# Altium project RESTURANT ROBOT.PrjPcb
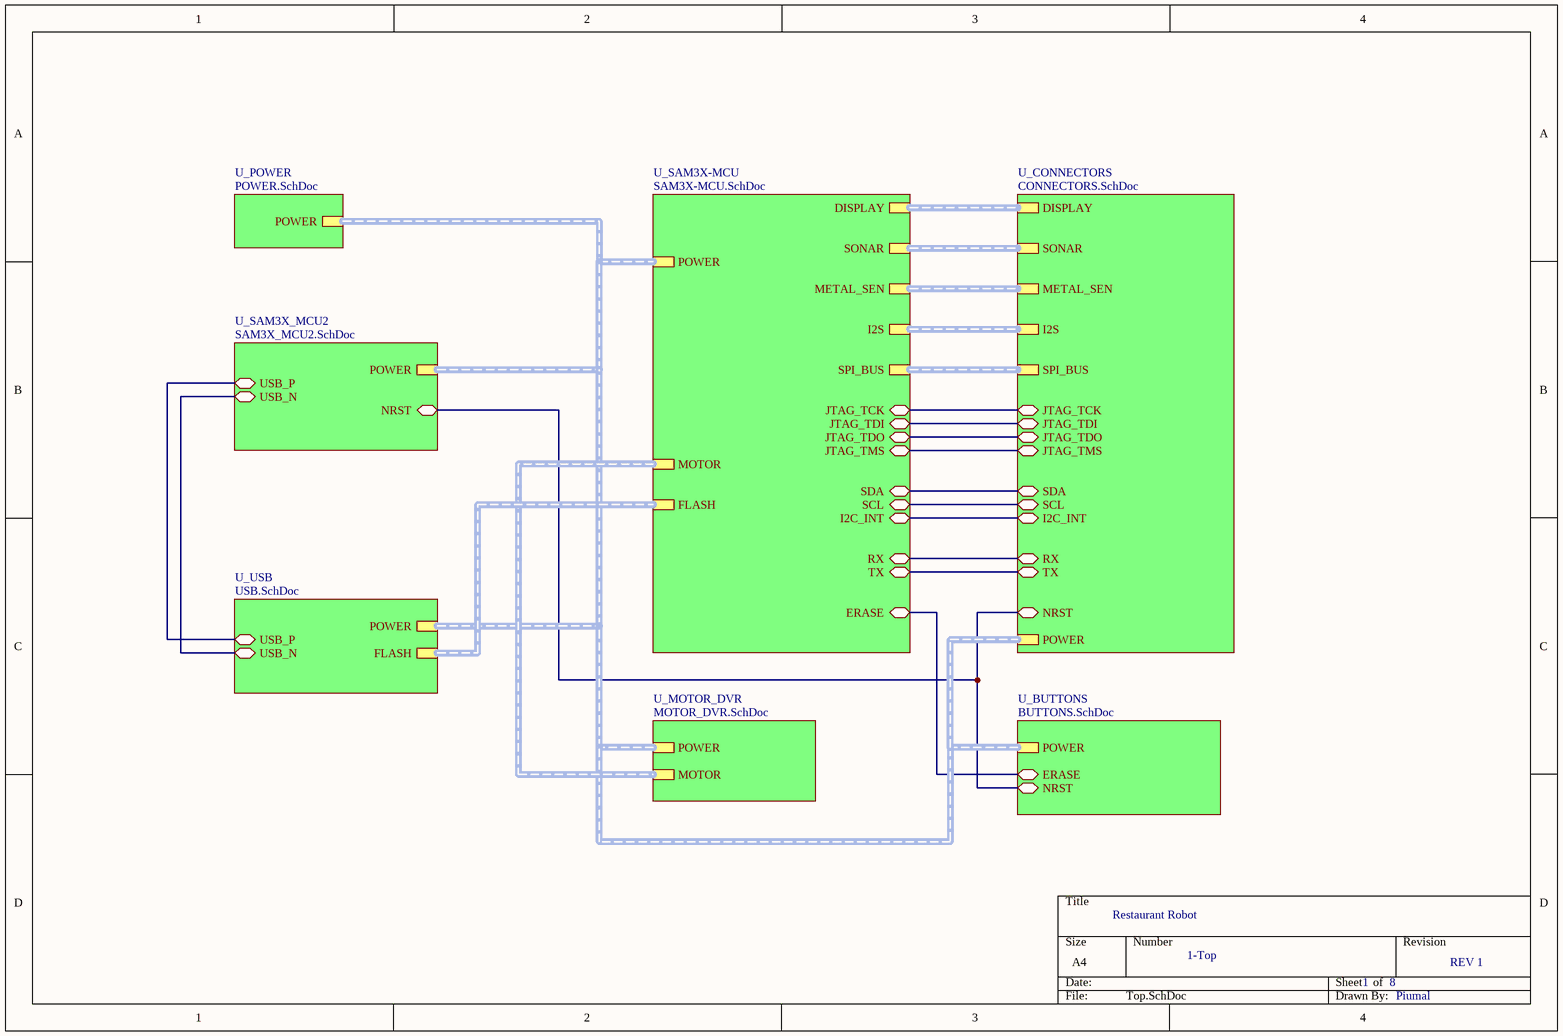
[diagram p0: Top.SchDoc]
4 sheets, 48 parts. Net scope: hierarchical (ports join the sheet entries above them; power ports are global).
Board file: PCB.PcbDoc
Sheets:
  Top.SchDoc
    U_SAM3X_MCU2 = SAM3X_MCU2.SchDoc
    U_BUTTONS = BUTTONS.SchDoc
    U_POWER = POWER.SchDoc

## Sheet Top.SchDoc
size A4; SheetNumber: 1; SheetTotal: 8

### Sub-sheets
U_BUTTONS = BUTTONS.SchDoc: ERASE (bidir), NRST (bidir), POWER (harness POWER)
U_CONNECTORS = CONNECTORS.SchDoc (file not in this document): DISPLAY (harness DISPLAY), SONAR (harness SONAR), METAL_SEN (harness METAL_SEN), I2S (harness I2S), JTAG_TCK (bidir), JTAG_TDI (bidir), JTAG_TDO (bidir), JTAG_TMS (bidir), RX (bidir), TX (bidir), SDA (bidir), SCL (bidir), I2C_INT (bidir), NRST (bidir), SPI_BUS (harness SPI_BUS), POWER (harness POWER)
U_MOTOR_DVR = MOTOR_DVR.SchDoc (file not in this document): MOTOR (harness MOTOR), POWER (harness POWER)
U_POWER = POWER.SchDoc: POWER (harness POWER)
U_SAM3X-MCU = SAM3X-MCU.SchDoc (file not in this document): MOTOR (harness MOTOR), FLASH (harness FLASH), SONAR (harness SONAR), I2S (harness I2S), METAL_SEN (harness METAL_SEN), DISPLAY (harness DISPLAY), JTAG_TCK (bidir), JTAG_TDI (bidir), JTAG_TDO (bidir), JTAG_TMS (bidir), RX (bidir), TX (bidir), ERASE (bidir), SDA (bidir), SCL (bidir), I2C_INT (bidir), SPI_BUS (harness SPI_BUS), POWER (harness POWER)
U_SAM3X_MCU2 = SAM3X_MCU2.SchDoc: USB_P (bidir), USB_N (bidir), NRST (bidir), POWER (harness POWER)
U_USB = USB.SchDoc (file not in this document): USB_P (bidir), USB_N (bidir), FLASH (harness FLASH), POWER (harness POWER)

### Nets
ERASE: sheet U_SAM3X-MCU/ERASE, sheet U_BUTTONS/ERASE
NRST: sheet U_SAM3X_MCU2/NRST, sheet U_BUTTONS/NRST, sheet U_CONNECTORS/NRST
USB_N: sheet U_SAM3X_MCU2/USB_N, sheet U_USB/USB_N
USB_P: sheet U_SAM3X_MCU2/USB_P, sheet U_USB/USB_P
(unnamed): sheet U_SAM3X-MCU/JTAG_TCK, sheet U_CONNECTORS/JTAG_TCK
(unnamed): sheet U_SAM3X-MCU/JTAG_TDI, sheet U_CONNECTORS/JTAG_TDI
(unnamed): sheet U_SAM3X-MCU/JTAG_TDO, sheet U_CONNECTORS/JTAG_TDO
(unnamed): sheet U_SAM3X-MCU/JTAG_TMS, sheet U_CONNECTORS/JTAG_TMS
(unnamed): sheet U_SAM3X-MCU/RX, sheet U_CONNECTORS/RX
(unnamed): sheet U_SAM3X-MCU/TX, sheet U_CONNECTORS/TX
(unnamed): sheet U_SAM3X-MCU/SDA, sheet U_CONNECTORS/SDA
(unnamed): sheet U_SAM3X-MCU/SCL, sheet U_CONNECTORS/SCL
(unnamed): sheet U_SAM3X-MCU/I2C_INT, sheet U_CONNECTORS/I2C_INT

### Buses and harness runs
harness sheet U_BUTTONS/POWER = sheet U_CONNECTORS/POWER = sheet U_MOTOR_DVR/POWER = sheet U_POWER/POWER = sheet U_SAM3X-MCU/POWER = sheet U_SAM3X_MCU2/POWER = sheet U_USB/POWER
harness sheet U_CONNECTORS/DISPLAY = sheet U_SAM3X-MCU/DISPLAY
harness sheet U_CONNECTORS/I2S = sheet U_SAM3X-MCU/I2S
harness sheet U_CONNECTORS/METAL_SEN = sheet U_SAM3X-MCU/METAL_SEN
harness sheet U_CONNECTORS/SONAR = sheet U_SAM3X-MCU/SONAR
harness sheet U_CONNECTORS/SPI_BUS = sheet U_SAM3X-MCU/SPI_BUS
harness sheet U_MOTOR_DVR/MOTOR = sheet U_SAM3X-MCU/MOTOR
harness sheet U_SAM3X-MCU/FLASH = sheet U_USB/FLASH

### Notes on the sheet
- Restaurant Robot
- 1-Top
- 1
- 8
- REV 1
- Piumal

## Sheet SAM3X_MCU2.SchDoc
size A3; SheetNumber: 3; SheetTotal: 8
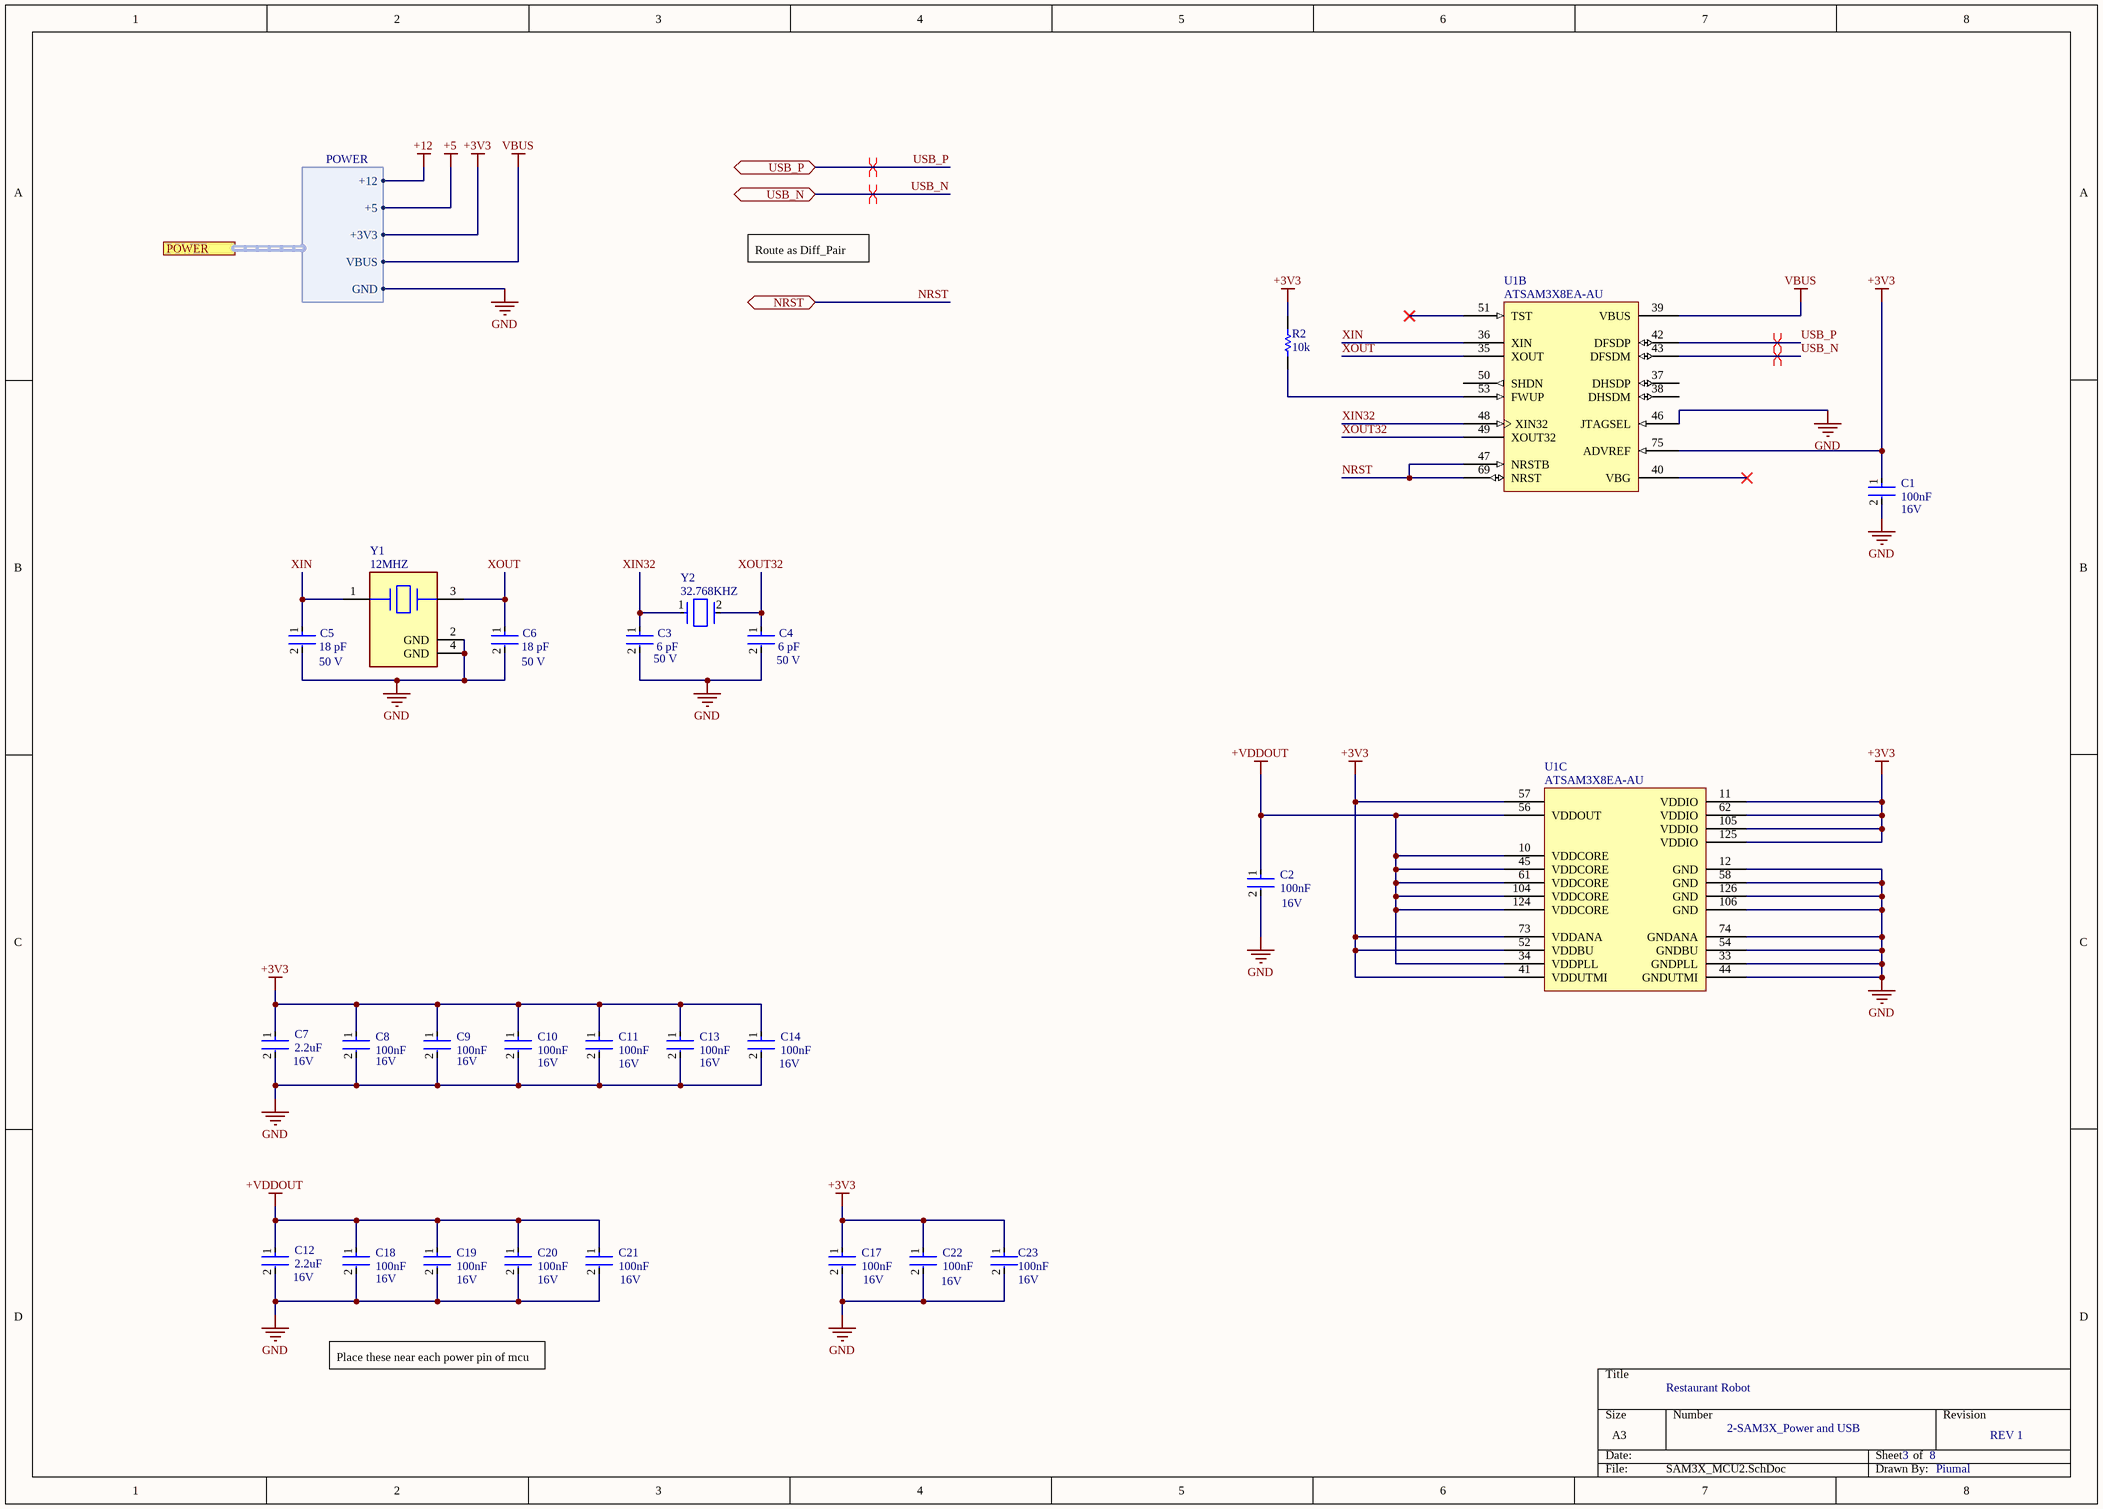
[diagram p1: SAM3X_MCU2.SchDoc]

### Parts
C1  Voltage Rating (DC): 16V  Capacitance: 100nF  [FP-CL21-IPC_A]  (hidden comment: CL21B104KOANNNC)
C2  Voltage Rating (DC): 16V  Capacitance: 100nF  [FP-CL21-IPC_A]  (hidden comment: CL21B104KOANNNC)
C3  Capacitance: 6 pF  Voltage Rating: 50 V  [FP-C0805C-DN-MFG]  (hidden comment: C0805C120J5GACTU)
C4  Capacitance: 6 pF  Voltage Rating: 50 V  [FP-C0805C-DN-MFG]  (hidden comment: C0805C120J5GACTU)
C5  Capacitance: 18 pF  Voltage Rating: 50 V  [FP-C0805C-DN-MFG]  (hidden comment: C0805C120J5GACTU)
C6  Capacitance: 18 pF  Voltage Rating: 50 V  [FP-C0805C-DN-MFG]  (hidden comment: C0805C120J5GACTU)
C7  Voltage Rating: 16V  Capacitance: 2.2uF  [FP-CL21-IPC_A]  (hidden comment: CL21A225KOFNNNG)
C8  Voltage Rating (DC): 16V  Capacitance: 100nF  [FP-CL21-IPC_A]  (hidden comment: CL21B104KOANNNC)
C9  Voltage Rating (DC): 16V  Capacitance: 100nF  [FP-CL21-IPC_A]  (hidden comment: CL21B104KOANNNC)
C10  Voltage Rating (DC): 16V  Capacitance: 100nF  [FP-CL21-IPC_A]  (hidden comment: CL21B104KOANNNC)
C11  Voltage Rating (DC): 16V  Capacitance: 100nF  [FP-CL21-IPC_A]  (hidden comment: CL21B104KOANNNC)
C12  Voltage Rating: 16V  Capacitance: 2.2uF  [FP-CL21-IPC_A]  (hidden comment: CL21A225KOFNNNG)
C13  Voltage Rating (DC): 16V  Capacitance: 100nF  [FP-CL21-IPC_A]  (hidden comment: CL21B104KOANNNC)
C14  Voltage Rating (DC): 16V  Capacitance: 100nF  [FP-CL21-IPC_A]  (hidden comment: CL21B104KOANNNC)
C17  Voltage Rating (DC): 16V  Capacitance: 100nF  [FP-CL21-IPC_A]  (hidden comment: CL21B104KOANNNC)
C18  Voltage Rating (DC): 16V  Capacitance: 100nF  [FP-CL21-IPC_A]  (hidden comment: CL21B104KOANNNC)
C19  Voltage Rating (DC): 16V  Capacitance: 100nF  [FP-CL21-IPC_A]  (hidden comment: CL21B104KOANNNC)
C20  Voltage Rating (DC): 16V  Capacitance: 100nF  [FP-CL21-IPC_A]  (hidden comment: CL21B104KOANNNC)
C21  Voltage Rating (DC): 16V  Capacitance: 100nF  [FP-CL21-IPC_A]  (hidden comment: CL21B104KOANNNC)
C22  Voltage Rating (DC): 16V  Capacitance: 100nF  [FP-CL21-IPC_A]  (hidden comment: CL21B104KOANNNC)
C23  value 100nF  Voltage Rating (DC): 16V  [FP-CL21-IPC_A]  (hidden comment: CL21B104KOANNNC)
R2  Resistance: 10k  [RESC2013X60X35ML10T20]  (hidden comment: RC0805JR-0710KL)
U1  ATSAM3X8EA-AU  [LQFP144_M]  (parts B,C of 3)
Y1  12MHZ  [FP-ABM8G-MFG]
Y2  32.768KHZ  [FP-NX3215SA-MFG]

### Ports
NRST (bidir), POWER (harness POWER), USB_N (bidir), USB_P (bidir)

### Harnesses
POWER: +3V3, GND, +5, VBUS, +12

### Nets
+3V3: C1.1 C7.1 C8.1 C9.1 C10.1 C11.1 C13.1 C14.1 C17.1 C22.1 C23.1 R2.2 U1.11(VDDIO) U1.41(VDDUTMI) U1.52(VDDBU) U1.57(VDDIN) U1.62(VDDIO) U1.73(VDDANA) U1.75(ADVREF) U1.105(VDDIO) U1.125(VDDIO) ; port POWER.+3V3
+VDDOUT: C2.1 C12.1 C18.1 C19.1 C20.1 C21.1 U1.10(VDDCORE) U1.34(VDDPLL) U1.45(VDDCORE) U1.56(VDDOUT) U1.61(VDDCORE) U1.104(VDDCORE) U1.124(VDDCORE)
GND: C1.2 C2.2 C3.2 C4.2 C5.2 C6.2 C7.2 C8.2 C9.2 C10.2 C11.2 C12.2 C13.2 C14.2 C17.2 C18.2 C19.2 C20.2 C21.2 C22.2 C23.2 U1.12(GND) U1.33(GNDPLL) U1.44(GNDUTMI) U1.46(JTAGSEL) U1.54(GNDBU) U1.58(GND) U1.74(GNDANA) U1.106(GND) U1.126(GND) Y1.2(GND) Y1.4(GND) ; port POWER.GND
VBUS: U1.39(VBUS) ; port POWER.VBUS
NRST: U1.47(NRSTB) U1.69(NRST) ; port NRST
USB_N: U1.43(DFSDM) ; port USB_N
USB_P: U1.42(DFSDP) ; port USB_P
XIN: C5.1 U1.36(XIN) Y1.1
XIN32: C3.1 U1.48(XIN32) Y2.1
XOUT: C6.1 U1.35(XOUT) Y1.3
XOUT32: C4.1 U1.49(XOUT32) Y2.2
NetR2_1: R2.1 U1.53(FWUP)

Not connected (* = marked no-connect by the designer): U1 37(DHSDP) 38(DHSDM) 40(VBG)* 50(SHDN) 51(TST)*

### Layout directives
differential pair; rule Signal Stimulus [Kind - Single Pulse    Level - High    Start Time = 0.000    Stop Time = 41.67    Period Time = 83.33]: USB_P
differential pair: USB_N, USB_P

### Notes on the sheet
- Route as Diff_Pair
- Place these near each power pin of mcu
- Restaurant Robot
- 2-SAM3X_Power and USB
- 3
- 8
- REV 1
- Piumal

### Library data of the parts
C1 C2 C8-C11 C13 C14 C17-C23 = CMP-13271-003679-1: CL21 Series 0805 100nF 16V ±10% Tolerance X7R Multilayer Ceramic Chip Capacitor; Lead Free: Lead Free; Width: 0.049inch; Tolerance: 10%; Min Operating Temperature: -55°C; Dielectric: X7R; Case Code (Metric): 2012; Packaging: Tape and Reel; Radiation Hardening: No; Length: 2mm; Height: 0.65mm; Voltage Rating: 16V; Mount: Surface Mount; Max Operating Temperature: 125°C; Depth: 1.25mm; Thickness: 0.03inch; Case Code (Imperial): 0805; Case/Package: 0805; Package Quantity: 1
C3-C6 = CMP-2007-00441-2: CAP CER 12PF 50V C0G/NP0 0805; Manufacturer: KEMET; Temperature Characteristic: C0G; Temperature Coefficient: 30ppm/°C; Material: Ceramic; Tolerance: 0.05; Height: 0.88mm; ComponentLink2URL: https://content.kemet.com/datasheets/KEM_C1003_C0G_SMD.pdf; Automotive: No; Device Class L2: Capacitors; Digikey Description: CAP CER 12PF 50V C0G/NP0 0805; Value: 12 pF; Device Class L3: Ceramic Capacitors; Mouser Description: Multilayer Ceramic Capacitors MLCC - SMD/SMT 50volts 12pF C0G 5%; Device Class L1: Passive Components; ComponentLink2Description: Datasheet; RoHS: TRUE; Temperature Range High: +125°C; Lead Free: Yes; Category: Cap; Ipc Land Pattern Name: CAPC200125X78; Package: C0805C-DN; Manufacturer Part Number: C0805C120J5GACTU; Octopart: https://octopart.com/c0805c120j5gactu-kemet-126518; Temperature Range Low: -55°C; Temperature: -55°C to +125°C
C7 C12 = CMP-13271-001347-1: CL21 Series 0805 2.2uF 16V ±10% Tolerance X5R Multilayer Ceramic Chip Capacitor; Width: 0.049inch; Min Operating Temperature: -55°C; Length: 0.079inch; Mount: Surface Mount; Tolerance: 10%; Package Quantity: 3000; Case Code (Imperial): 0805; Case Code (Metric): 2012; Thickness: 0.053inch; Packaging: Tape and Reel; Case/Package: 0805; Max Operating Temperature: 85°C
R2 = CMP-2000-05025-1: Chip Resistor, 10 KOhm, +/- 5%, 0.125 W, -55 to 155 degC, 0805 (2012 Metric), RoHS, Tape and Reel; Manufacturer: Yageo; Resistor Element Type: ThickFilm; Voltage Rating: 150V; Product Range: RCSeries; SVHC: ToBeAdvised; Resistor Case Style: 0805[2012Metric]; Temperature Coefficient: ±100ppm/degC; Power Rating: 250mW; Automotive Qualification Standard: -; Datasheet Version: REV. 2, 09/2004; Packaging: CutTape; Resistance Tolerance: ±5%; MSL: MSL1-Unlimited; Manufacturer URL: http://www.yageo.com/; Datasheet URL: http://www.yageo.ru/pdf/RC0805.pdf; Package Description: 2-Pin Surface Mounted Device, Body 2 x 1.25 mm; Package Reference: 805
U1 = CMP-0076-00188-1: SAM3X ARM Cortex-M3 Flash-based Microcontroller, 512 KB Flash, 96 KB SRAM, 103 User I/Os, 1.62 to 3.6 V, -40 to 85 degC, 144-Pin LQFP, RoHS; Manufacturer: Atmel; UART: 5; Max. Operating Freq.: 84 MHz; ADC Resolution: 12 bits; Flash: 512 Kbytes; ADC Channels: 16; SRAM: 96 Kbytes; Max I/O Pins: 103; DAC Channels: 2; SPI: 4; # of Touch Channels: 32; Mounting Technology: Surface Mount; Operating Voltage: 1.62 to 3.6 V; ComponentLink2URL: http://www.atmel.com/Images/doc11057.pdf; CAN: 2; ComponentLink1Description: Manufacturer URL; RoHS: TRUE; PartNumber: ATSAM3X8EA-AU; Temp. Range: -40 to 85 degC; PackageVersion: 11057B; PackageDescription: 100-Pin Quad Flat Package, Body 20 x 20 mm, Pitch 0.5 mm; ComponentLink2Description: Datasheet; DatasheetVersion: 11057B; ComponentLink1URL: http://www.atmel.com/; ComponentLink3Description: Package Specification; ComponentLink3URL: http://www.atmel.com/Images/doc11057.pdf; PackageReference: LQFP-144
Y1 = CMP-2000-05039-3: Crystal 12MHz ±20ppm (Tol) ±30ppm (Stability) 18pF FUND 120Ω 4-Pin SMD T/R; Series Resistance: 120R; Max Operating Temperature: 85°C; Mount: Surface Mount; Width: 2.5mm; Series: ABM8G; Termination: SMD/SMT; Frequency Tolerance: 20ppm; Tolerance: 20ppm; Min Operating Temperature: -40°C; Operating Frequency: 12 MHz; Depth: 2.5mm; Load Capacitance: 18pF; Number of Pins: 4; Length: 3.2mm; Radiation Hardening: No; Frequency Stability: 30ppm; Height: 1mm; Packaging: Tape and Reel; Package Quantity: 1000; ESR (Equivalent Series Resistance): 120R; Lead Free: Lead Free; Frequency: 12MHz; Case/Package: CSMD; Parameter 1: *
Y2 = CMP-00536-22488149-1: NX3215SA-32.768K-STD-MUA-14 Parallel - Fundamental Quartz Crystal, 0.032768MHz Nom; ESR (Equivalent Series Resistance): 70kΩ; Frequency Tolerance: 0.002%; Load Capacitance: 6pF; Width: 1.4986mm; Length: 3.2004mm; RoHS: Compliant; Case/Package: SMD/SMT; Mount: Surface Mount; Height: 889µm; Number of Pins: 2; Packaging: Tape & Reel (TR); Max Operating Temperature: 85°C; Frequency: 32.768kHz; NexarPartId: 22488149; Min Operating Temperature: -40°C

## Sheet BUTTONS.SchDoc
size A3; SheetNumber: 6; SheetTotal: 8
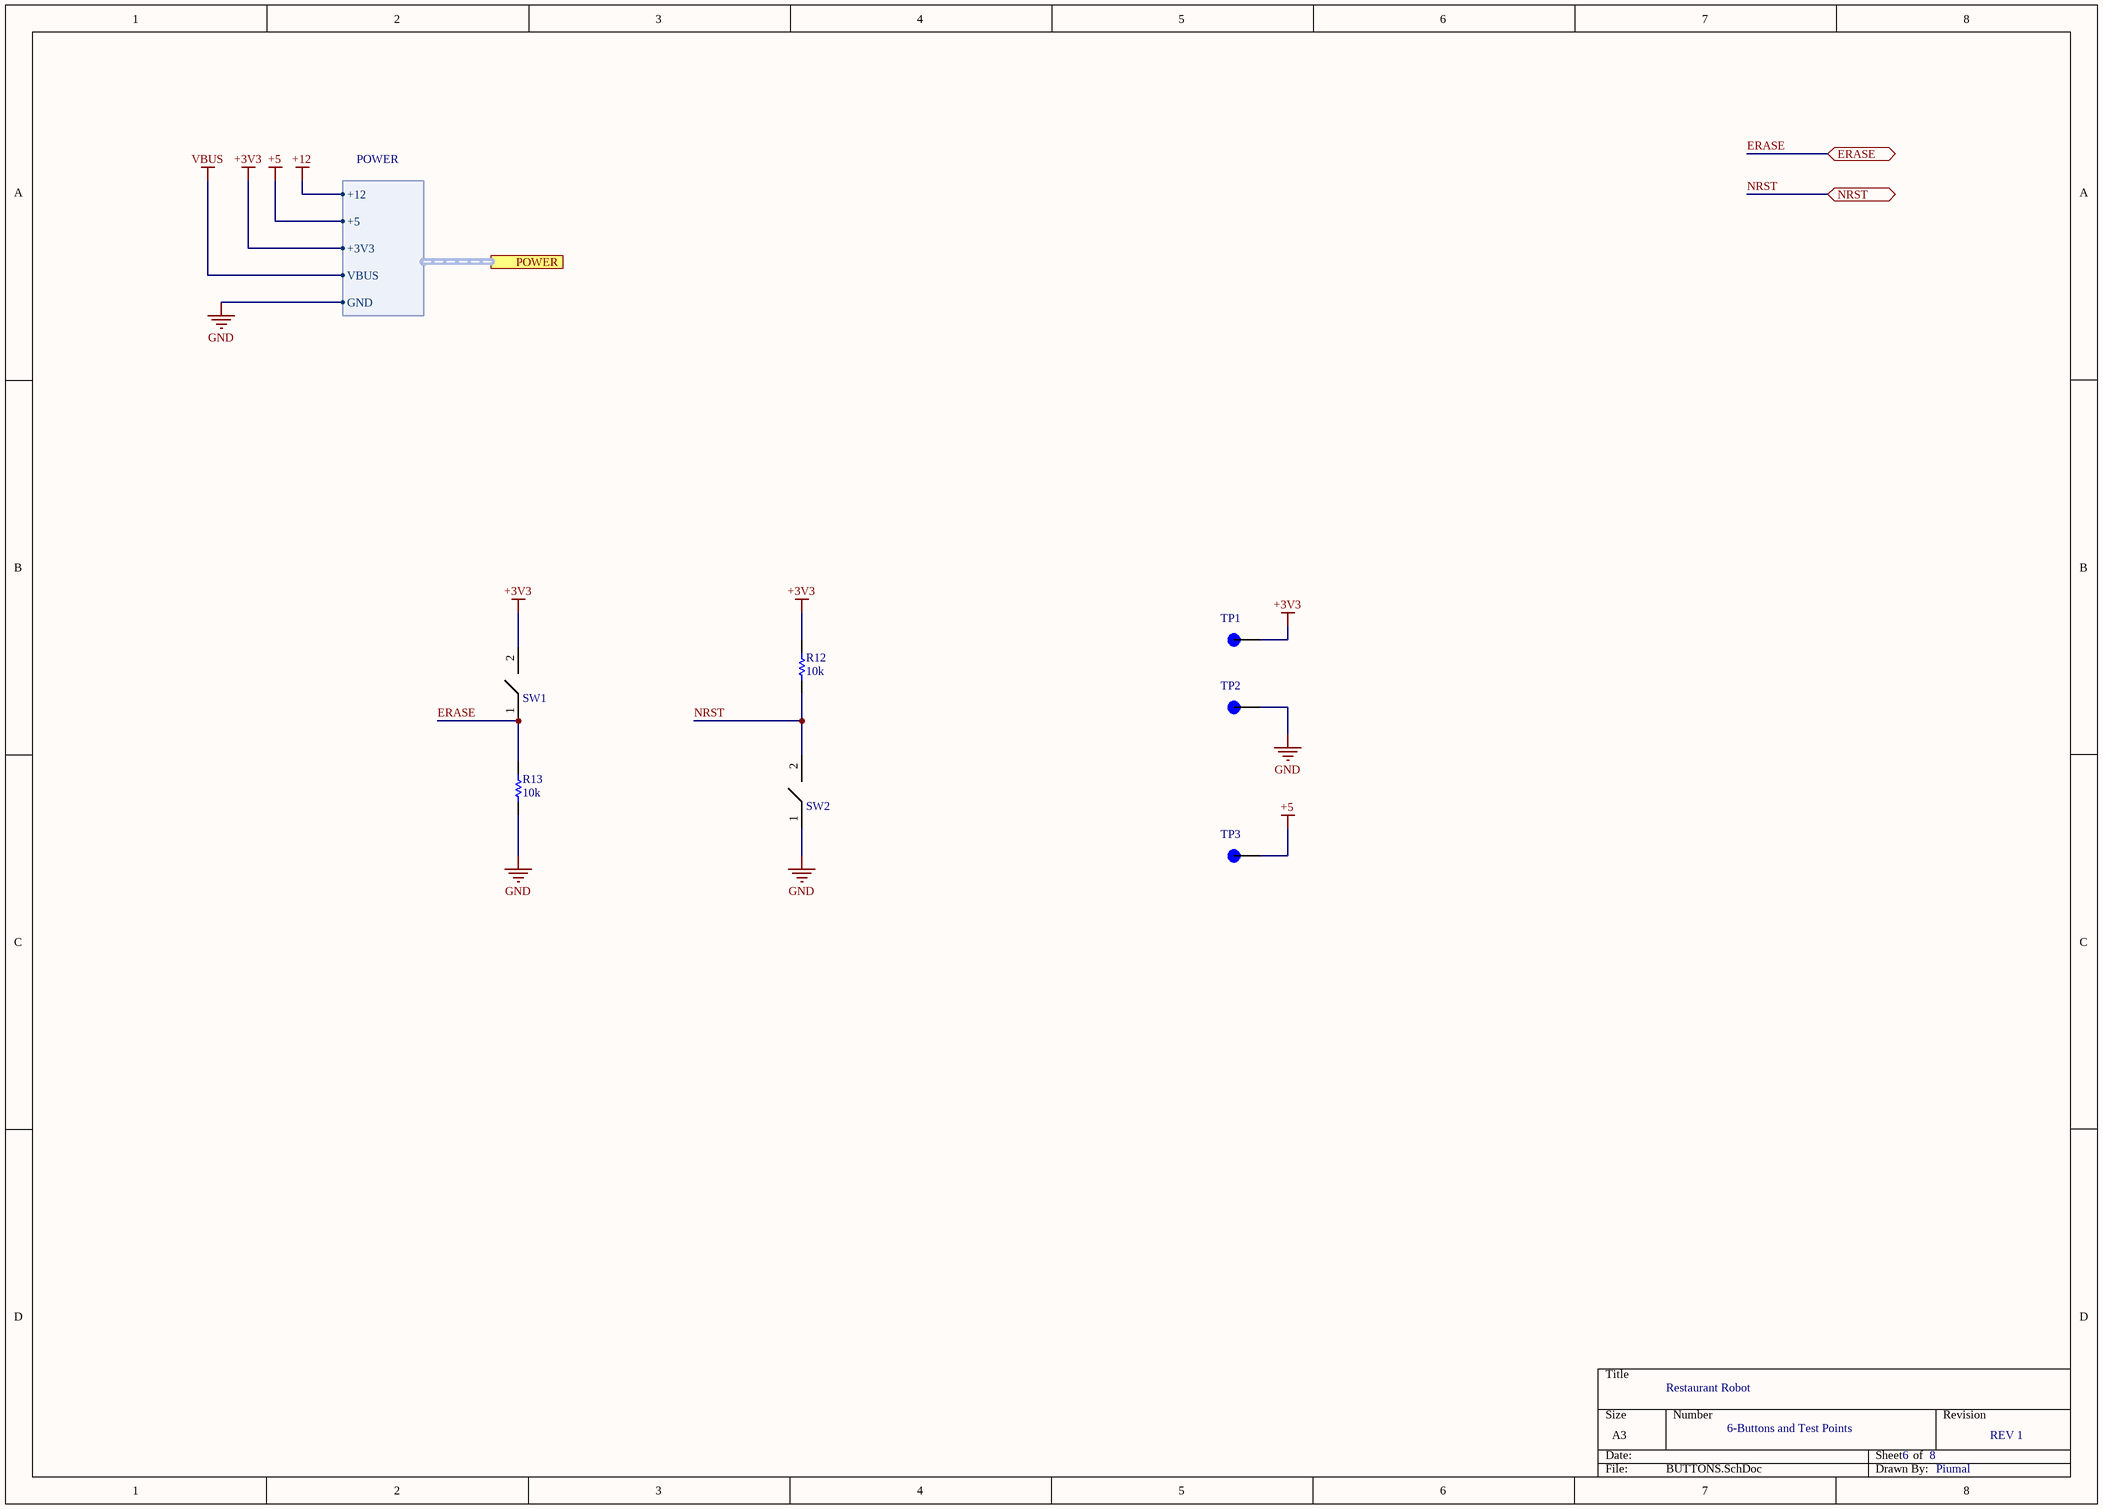
[diagram p2: BUTTONS.SchDoc]

### Parts
R12  Resistance: 10k  [RESC2013X60X35ML10T20]  (hidden comment: RC0805JR-0710KL)
R13  Resistance: 10k  [RESC2013X60X35ML10T20]  (hidden comment: RC0805JR-0710KL)
SW1  SWITCH  [PCBComponent_1]  (value not drawn)
SW2  SWITCH  [PCBComponent_1]  (value not drawn)
TP1  5000  [KEYSTONE_5000]  (value not drawn)
TP2  5000  [KEYSTONE_5000]  (value not drawn)
TP3  5000  [KEYSTONE_5000]  (value not drawn)

### Ports
ERASE (bidir), NRST (bidir), POWER (harness POWER)

### Harnesses
POWER: +3V3, GND, +5, VBUS, +12

### Nets
+3V3: R12.2 SW1.2 TP1.TP ; port POWER.+3V3
+5: TP3.TP ; port POWER.+5
GND: R13.1 SW2.1 TP2.TP ; port POWER.GND
ERASE: R13.2 SW1.1 ; port ERASE
NRST: R12.1 SW2.2 ; port NRST

### Notes on the sheet
- Restaurant Robot
- 6-Buttons and Test Points
- 6
- 8
- REV 1
- Piumal

### Library data of the parts
R12 R13 = CMP-2000-05025-1: as R2 on sheet SAM3X_MCU2; Automotive Qualification Standard: -; Datasheet Version: REV. 2, 09/2004; Packaging: CutTape; Resistance Tolerance: ±5%; MSL: MSL1-Unlimited; Manufacturer URL: http://www.yageo.com/; Datasheet URL: http://www.yageo.ru/pdf/RC0805.pdf; Package Description: 2-Pin Surface Mounted Device, Body 2 x 1.25 mm; Package Reference: 805
SW1 SW2 = SW: SWITCH TACTILE SPST-NO 0.05A 12V
TP1-TP3 = 5000: Test Point Miniature THM H .300 Nylon 46 Insulated Red PhosBronze/Silver | Keystone Electronics 5000; SnapEDA_Link: https://www.snapeda.com/parts/5000/Keystone/view-part/?ref=snap; Package: Test Point Keystone Electronics; Value: *; MF: Keystone Electronics; MP: 5000; Check_prices: https://www.snapeda.com/parts/5000/Keystone/view-part/?ref=eda

## Sheet POWER.SchDoc
size A3; SheetNumber: 8; SheetTotal: 8
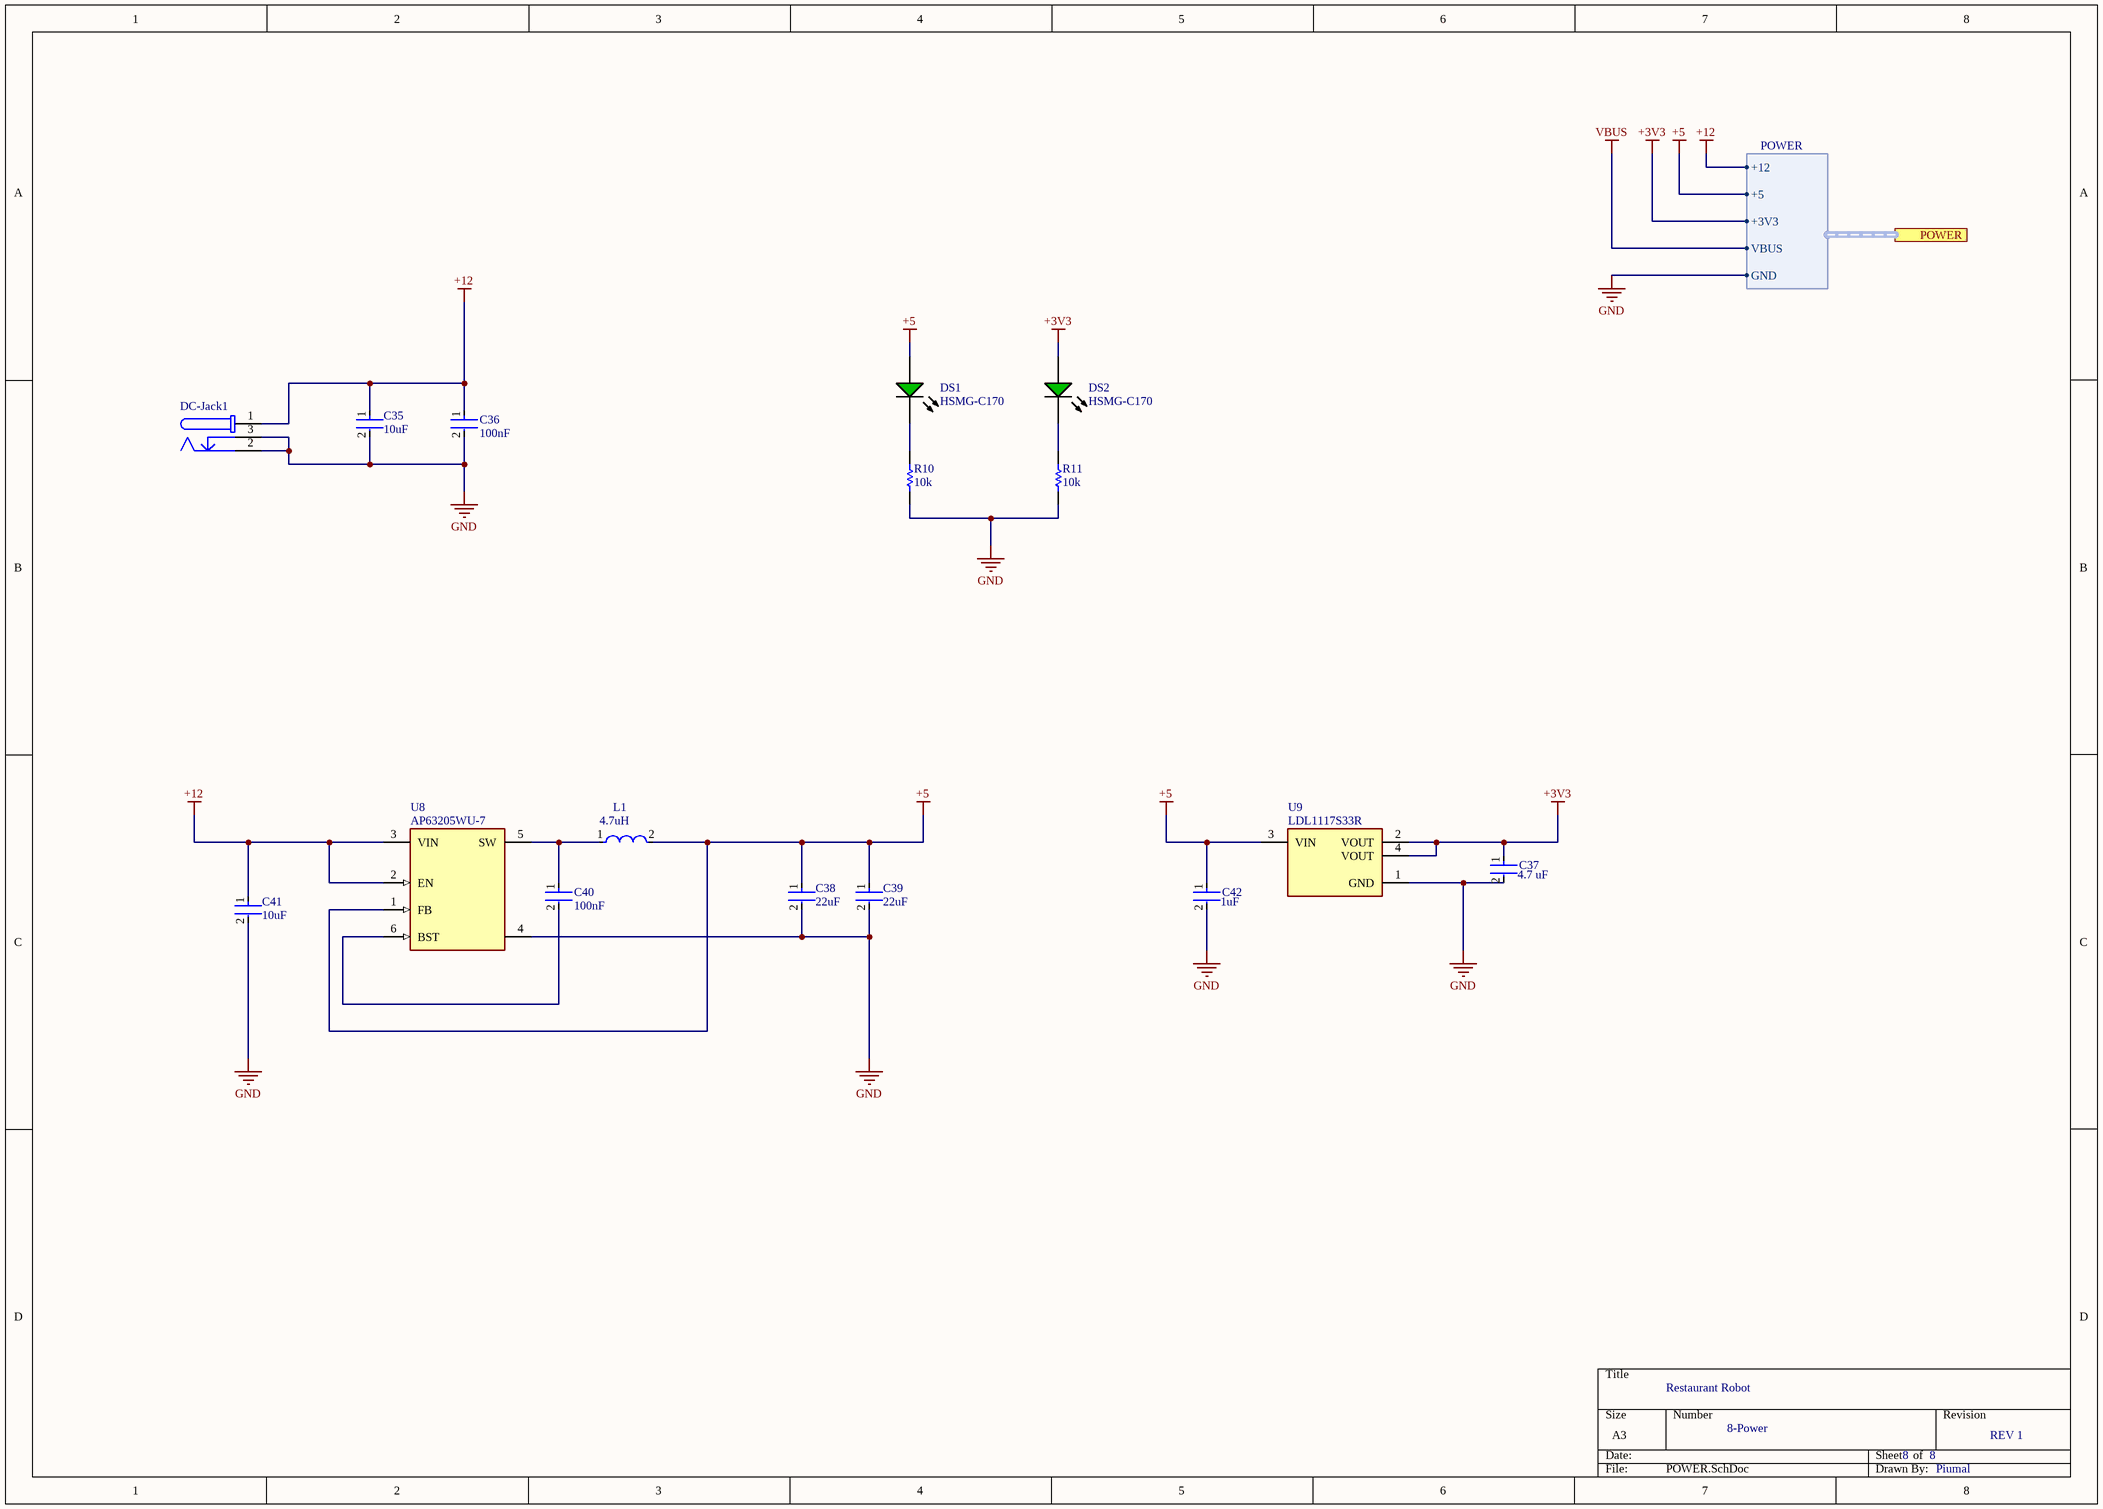
[diagram p3: POWER.SchDoc]

### Parts
C35  Capacitance: 10uF  [FP-1206-L_3_2_0_2-W_1_6_0-IPC_A]  (hidden comment: 1206ZD106KAT2A)
C36  100nF  [FP-0805-L_2_01_0_2-W_1_25-IPC_B]
C37  Capacitance: 4.7 uF  [FP-CC1206-1_25-MFG]  (hidden comment: CC1206KKX7R9BB475)
C38  Capacitance: 22uF  [FP-C3216-160-0_2-IPC_B]  (hidden comment: C3216X5R1E226M160AB)
C39  Capacitance: 22uF  [FP-C3216-160-0_2-IPC_B]  (hidden comment: C3216X5R1E226M160AB)
C40  100nF  [FP-0805-L_2_01_0_2-W_1_25-IPC_B]
C41  Capacitance: 10uF  [FP-1206-L_3_2_0_2-W_1_6_0-IPC_A]  (hidden comment: 1206ZD106KAT2A)
C42  Capacitance: 1uF  [FP-1206-L_3_2_0_2-W_1_6_0-IPC_A]  (hidden comment: 12065C105KAT2A)
DC-Jack1  694106301002  [694106301002]  (value not drawn)
DS1  HSMG-C170  [AVAG-HSMX-C170_V]
DS2  HSMG-C170  [AVAG-HSMX-C170_V]
L1  Inductance: 4.7uH  [FP-IHLP-2525BD-FP_2_413x3-MFG]  (hidden comment: IHLP2525BDER4R7M01)
R10  Resistance: 10k  [RESC2013X60X35ML10T20]  (hidden comment: RC0805JR-0710KL)
R11  Resistance: 10k  [RESC2013X60X35ML10T20]  (hidden comment: RC0805JR-0710KL)
U8  AP63205WU-7  [FP-TSOT26-MFG]
U9  LDL1117S33R  [FP-SOT223-0046067-IPC_C]

### Ports
POWER (harness POWER)

### Harnesses
POWER: +3V3, GND, +5, VBUS, +12

### Nets
+3V3: C37.1 DS2.1(A) U9.2(VOUT) U9.4(VOUT) ; port POWER.+3V3
+5: C38.1 C39.1 C42.1 DS1.1(A) L1.2 U8.1(FB) U9.3(VIN) ; port POWER.+5
+12: C35.1 C36.1 C41.1 DC-Jack1.1 U8.2(EN) U8.3(VIN) ; port POWER.+12
GND: C35.2 C36.2 C37.2 C38.2 C39.2 C41.2 C42.2 DC-Jack1.2 DC-Jack1.3 R10.2 R11.2 U8.4(GND) U9.1(GND) ; port POWER.GND
NetC40_1: C40.1 L1.1 U8.5(SW)
NetC40_2: C40.2 U8.6(BST)
NetDS1_2: DS1.2(K) R10.1
NetDS2_2: DS2.2(K) R11.1

### Notes on the sheet
- Restaurant Robot
- 8-Power
- 8
- REV 1
- Piumal

### Library data of the parts
C35 C41 = CMP-04427-021870-1: General Purpose Ceramic Capacitor, 1206, 10uF, 10%, X5R, 15%, 10V; Tolerance: 10%; Thickness: 0.07inch; Voltage: 10V; Termination: SMD/SMT; REACH SVHC: No SVHC; Radiation Hardening: No; Lead Free: Lead Free; Min Operating Temperature: -55°C; Contact Plating: Tin; Length: 3.2mm; Dielectric: X5R; Packaging: Tape and Reel; Construction: Flat; RoHS Compliant: Yes; Series: -; Voltage Rating: 10V; Height: 0.07mm; Width: 0.063inch; Voltage Rating (DC): 10V; Mount: Surface Mount; Depth: 1.6mm; Number of Pins: 2; Case Code (Imperial): 1206; Size: 1.78mm; Case/Package: 1206; Max Operating Temperature: 85°C; Package Quantity: 1; Case Code (Metric): 3216
C36 C40 = CMP-2007-04172-2: Automotive Ceramic Capacitor, 0805, 100nF, 10%, X7R, 15%, 100V; Voltage Rating (DC): 100V; Case Code (Metric): 2012; Mount: Surface Mount; Length: 2.01mm; Depth: 1.25mm; Lead Free: Lead Free; Ratings: AEC-Q200; Max Operating Temperature: 125°C; Tolerance: 10%; Case/Package: 0805; Width: 0.049inch; Package Quantity: 1; Thickness: 0.055inch; Construction: Flat; Min Operating Temperature: -55°C; REACH SVHC: No SVHC; Number of Pins: 2; Radiation Hardening: No; Capacitance: 100nF; Voltage Rating: 100V; Height: 1.4mm; Series: -; Voltage: 100V; Dielectric: X7R; Termination: SMD/SMT; Case Code (Imperial): 0805; RoHS Compliant: Yes; Packaging: Tape and Reel; Dielectric Material: Ceramic
C37 = CMP-03422-000173-1: CAP CER 4.7UF 50V X7R 1206; Manufacturer: Yageo; Automotive Grade: NA; Tolerance: 0.1; Temperature Coefficient: 15%; Material: Ceramic; Device Class L1: Passive Components; Category: Cap; Height: 1.45mm; Temperature Range Low: -55°C; Temperature Range High: +125°C; Manufacturer Part Number: CC1206KKX7R9BB475; Package: CC1206-1.25; Lead Free: Yes; Temperature: -55°C to +125°C; RoHS: TRUE; Digikey Description: CAP CER 4.7UF 50V X7R 1206; Voltage Rating: 50 V; Device Class L2: Capacitors; Footprint Url: http://www.yageo.com/exep/pages/download/literatures/UPY-C_GEN_24.pdf; ComponentLink2URL: http://www.yageo.com/documents/recent/UPY-NP0X7R_HV_1KV-to-3KV_11.pdf; Temperature Characteristic: X7R; Mouser Description: CC Series 1206 4.7 uF 50 V ±10% Tolerance X7R Multilayer Ceramic Capacitor; ComponentLink2Description: Datasheet; Device Class L3: Ceramic Capacitors; Octopart: https://octopart.com/cc1206kkx7r9bb475-yageo-50417574; Value: 4.7 uF; Automotive: No
C38 C39 = CMP-08246-004697-1: Multilayer Ceramic Capacitors 22uF ±20% 25V X5R SMD 1206; RoHS Compliant: Yes; Thickness: 0.071inch; Mount: Surface Mount; Termination: SMD/SMT; Height: 1.6mm; Resistor Type: Ceramic; REACH SVHC: No SVHC; Packaging: Tape and Reel; Construction: Flat; Depth: 1.6mm; Lead Free: Lead Free; Tolerance: 20%; Width: 0.063inch; Weight: 0.000571oz; Case Code (Imperial): 1206; Case/Package: 1206; Min Operating Temperature: -55°C; Package Quantity: 1; Voltage Rating (DC): 25V; Length: 3.2mm; Voltage Rating: 25V; Case Code (Metric): 3216; Dielectric: X5R; Series: C; Dielectric Material: Ceramic; Max Operating Temperature: 85°C
C42 = CMP-2000-05866-2: General Purpose Ceramic Capacitor, 1206, 1uF, 10%, X7R, 15%, 50V; Dissipation Factor: 2.5%; Voltage: 25V; Dielectric: X7R; Radiation Hardening: No; Number of Pins: 2; Package Quantity: 1; Case Code (Metric): 3216; Thickness: 0.07inch; Voltage Rating (DC): 50V; Width: 0.063inch; Construction: Flat; Min Operating Temperature: -55°C; Length: 3.2mm; Voltage Rating: 50V; Case Code (Imperial): 1206; Height: 1.78mm; REACH SVHC: No SVHC; Mount: Surface Mount; Max Operating Temperature: 125°C; Depth: 1.6mm; Packaging: Tape and Reel; Tolerance: 10%; Lead Free: Lead Free; Termination: SMD/SMT; RoHS Compliant: Yes; Case/Package: 1206; Contact Plating: Tin; Series: -
DC-Jack1 = CMP-1502-00188-2: NexarPartId: 52676100; Voltage Rating (DC): 20V; Gender: Male; Voltage Rating: 24V; Connector Type: Power; Insulation Resistance: 100MΩ; Current Rating: 5A; Shielding: Unshielded; Number of Contacts: 3; Color: Black; Housing Material: Polyamide; Contact Gender: Female; REACH SVHC: Unknown; Termination: Through Hole; Height: 11mm; RoHS: Compliant; Mount: Through Hole; Flammability Rating: UL94 V-0; Packaging: Bulk; Min Operating Temperature: -40°C; Contact Plating: Tin; Max Operating Temperature: 85°C; Operating Supply Voltage: 24V; Contact Material: Gold, Tin
DS1 DS2 = CMP-2000-05062-1: Chip LED, Green, 2.2 V, -40 to 85 degC, 2-Pin SMD, Pb-Free, Tape and Reel; Manufacturer: Avago; No. of Pins: 2; Peak Wavelength: 570nm; SVHC: NoSVHC(16-Jun-2014); Dominant Wavelength: 572nm; Forward Current If: 20mA; Viewing Angle: 170deg; Lens Shape: Rectangular; PIV Max: 5V; External Width: 1.25mm; LED Type: Standard; External Depth: 0.8mm; Opto Mounting Orientation: Top; Luminous Intensity: 15mcd; Luminous Intensity Min: 4mcd; Forward Voltage VF Max: 2.6V; External Length / Height: 2mm; Bulb Size: 1.25mmx1.4mm; Light Area Height: 1mm; Voltage Vf Typ: 2.2V; Operating Temperature Max: 85degC; Datasheet Version: Oct-08; MSL: MSL2A-4weeks; Peak Forward Current: 20mA; Package Description: 2-Pin Surface Mount Device, Body 2 x 1.25 mm, Height 0.8 mm; Datasheet URL: https://datasheet.ciiva.com/29280/180495-da-01-en-chip-led-hsmg-c170-gelb-gruen-29280971.pdf; Storage Temperature Min: -40degC; LED Colour: Green; Wavelength Typ: 570nm; Mounting Type: SMD; Forward Current If Max: 20mA; Dominant Wavelength Typ: 572nm; LED Mounting: SMD; Operating Temperature Range: -30degCto+85degC; Operating Temperature Min: -30degC; Manufacturer URL: http://www.avagotech.com/; Packaging: CutTape; Luminous Intensity Typ: 15mcd; Package Reference: HSMX-C170; Storage Temperature Max: 85degC; Opto Case Style: SMD; Forward Voltage: 2.2V
L1 = CMP-02424-000271-1: Commercial Inductors, High Saturation Series 4.7uH 4.5A 63mΩ 20%; Self Resonant Frequency: 5MHz; DC Resistance (DCR): 63mR; Max DC Current: 10A; Core Material: Metal; Test Frequency: 100kHz; Shielding: Shielded; Radiation Hardening: No; Number of Pins: 2525; Tolerance: 20%; Termination: SMD/SMT; Depth: 6.72mm; Military Standard: Not; Max Operating Temperature: 125°C; Min Operating Temperature: -55°C; RMS Current (Irms): 4.5A; Width: 6.47mm; Saturation Current: 10A; Height: 2.4mm; Case/Package: 2525; Packaging: Tape and Reel; Current Rating: 4.5A; Length: 6.86mm; Inductance Tolerance: 20%; Package Quantity: 2000; Lead Free: Lead Free; Height - Seated (Max): 0.094inch; Mount: Surface Mount
R10 R11 = CMP-2000-05025-1: as R2 on sheet SAM3X_MCU2; Automotive Qualification Standard: -; Datasheet Version: REV. 2, 09/2004; Packaging: CutTape; Resistance Tolerance: ±5%; MSL: MSL1-Unlimited; Manufacturer URL: http://www.yageo.com/; Datasheet URL: http://www.yageo.ru/pdf/RC0805.pdf; Package Description: 2-Pin Surface Mounted Device, Body 2 x 1.25 mm; Package Reference: 805
U8 = CMP-12757-000001-1: IC REG BUCK 5V 2A TSOT26; Manufacturer: Diodes Inc.; Max Junction Temp: +160°C; Max Duty Cycle: 100%; Standoff Height: 0.01mm; Max Supply Voltage: 32V; Number Of Outputs: 1; Min Supply Voltage: 3.8V; Output Type: Fixed; Switching Frequency: 1100kHz; Nominal Supply Current: 22uA; Automotive: No; RoHS: TRUE; Switching Topology: Buck; Temperature: -40°C to +85°C; Footprint Url: https://www.diodes.com/assets/Package-Files/TSOT26.pdf; Lead Free: Yes; Digikey Description: IC REG BUCK 5V 2A TSOT26; Device Class L3: Voltage Regulators - Switching; Ambient Temperature Range High: +85°C; Category: IC; Package: TSOT26; Output Voltage: 5V; Output Current: 2A; ComponentLink2Description: Datasheet; Device Class L2: Power Management ICs; Ambient Temperature Range Low: -40°C; Temperature Range High: +85°C; Temperature Range Low: -40°C; Octopart: https://octopart.com/ap63205wu-7-diodes+inc.-98099551; Manufacturer Part Number: AP63205WU-7; Height: 1mm; Device Class L1: Integrated Circuits (ICs); ComponentLink2URL: https://www.diodes.com/assets/Datasheets/AP63200-AP63201-AP63203-AP63205.pdf
U9 = CMP-12153-000006-1: IC REG LINEAR 3.3V 1.2A SOT223; Manufacturer: STMicroelectronics; Output Type: Fixed; Min Supply Voltage: 2.6V; Number Of Outputs: 1; Dropout Voltage: 350mV; Output Current: 2A; Nominal Supply Current: 250uA; Standoff Height: 0.02mm; Max Supply Voltage: 18V; Max Junction Temp: +125°C; Accuracy Percentage: 2%; Automotive: No; Device Class L2: Power Management ICs; Height: 1.9mm; Octopart: https://octopart.com/ldl1117s33r-stmicroelectronics-81876163; Output Voltage: 3.3V; Package: SOT223-0046067; Lead Free: Yes; Temperature Range Low: -40°C; Category: IC; Device Class L1: Integrated Circuits (ICs); Ipc Land Pattern Name: SOT230P700X190-4; Mouser Description: LDL1117 Series 1.2 A 3.3 V High PSRR LDO Linear Voltage Regulator-SOT-223; ComponentLink2Description: Datasheet; ComponentLink2URL: https://www.st.com/resource/en/datasheet/ldl1117.pdf; Device Class L3: Voltage Regulators - Linear; Manufacturer Part Number: LDL1117S33R; Temperature Range High: +125°C; Digikey Description: IC REG LINEAR 3.3V 1.2A SOT223; Temperature: -40°C to +125°C; RoHS: TRUE

## Nets that join several sheets
+3V3: SAM3X_MCU2 (21 pins), BUTTONS (R12.2 SW1.2 TP1.TP), POWER (C37.1 DS2.1 U9.2 U9.4)
+5: BUTTONS (TP3.TP), POWER (7 pins)
GND: SAM3X_MCU2 (32 pins), BUTTONS (R13.1 SW2.1 TP2.TP), POWER (13 pins)
NRST: SAM3X_MCU2 (U1.47 U1.69), BUTTONS (R12.1 SW2.2)